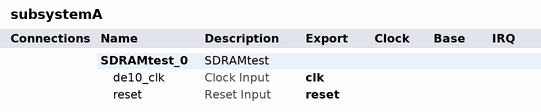
[diagram p0: system contents]
# Platform Designer (Qsys) system subsystemA, MAX 10 10M50DAF484C7G
# Parameters at their usual value, and those the tool derives, are not listed.
package require qsys
create_system subsystemA
set_project_property DEVICE_FAMILY {MAX 10}
set_project_property DEVICE 10M50DAF484C7G

add_instance SDRAMtest_0 SDRAMtest 1.0

# exported interfaces
add_interface clk clock sink
set_interface_property clk EXPORT_OF SDRAMtest_0.de10_clk
add_interface reset reset sink
set_interface_property reset EXPORT_OF SDRAMtest_0.reset

set_interconnect_requirement {$system} qsys_mm.clockCrossingAdapter HANDSHAKE
set_interconnect_requirement {$system} qsys_mm.enableEccProtection FALSE
set_interconnect_requirement {$system} qsys_mm.insertDefaultSlave FALSE
set_interconnect_requirement {$system} qsys_mm.maxAdditionalLatency 1

save_system subsystemA.qsys
